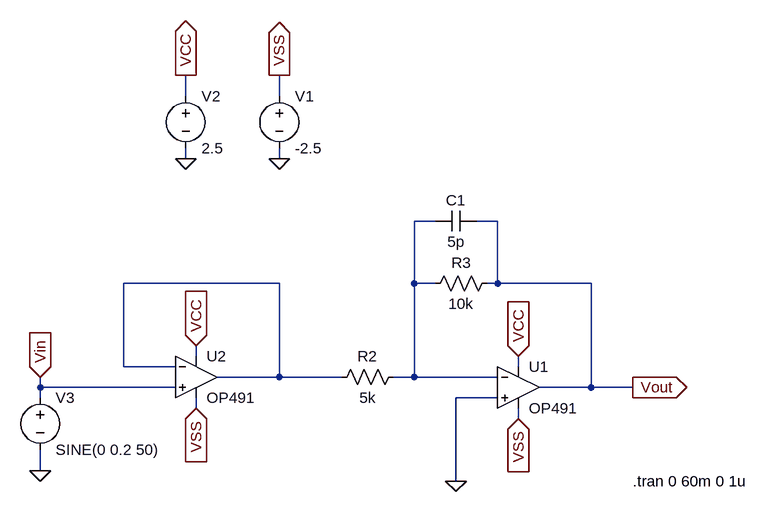
[diagram p0: schematic 008-Two-Stage-Inverting-Amplifier-With-High-Input-Impedance.asc]
008-Two-Stage-Inverting-Amplifier-With-High-Input-Impedance.asc, the LTspice schematic file:
Version 4
SHEET 1 880 680
WIRE -240 -96 -240 -128
WIRE -96 -96 -96 -128
WIRE -240 0 -240 -16
WIRE -96 0 -96 -16
WIRE 144 96 112 96
WIRE 240 96 208 96
WIRE -96 192 -336 192
WIRE 112 192 112 96
WIRE 144 192 112 192
WIRE 240 192 240 96
WIRE 240 192 224 192
WIRE 384 192 240 192
WIRE -224 304 -224 288
WIRE -336 320 -336 192
WIRE -256 320 -336 320
WIRE 272 320 272 304
WIRE -96 336 -96 192
WIRE -96 336 -192 336
WIRE 0 336 -96 336
WIRE 112 336 112 192
WIRE 112 336 80 336
WIRE 240 336 112 336
WIRE -464 352 -464 336
WIRE -256 352 -464 352
WIRE 384 352 384 192
WIRE 384 352 304 352
WIRE 448 352 384 352
WIRE -464 368 -464 352
WIRE 240 368 176 368
WIRE -224 384 -224 368
WIRE 272 400 272 384
WIRE -464 480 -464 448
WIRE 176 496 176 368
FLAG 176 496 0
FLAG -96 0 0
FLAG -240 0 0
FLAG -464 480 0
FLAG -464 336 Vin
IOPIN -464 336 In
FLAG 448 352 Vout
IOPIN 448 352 Out
FLAG -240 -128 VCC
IOPIN -240 -128 Out
FLAG -96 -128 VSS
IOPIN -96 -128 Out
FLAG 272 304 VCC
IOPIN 272 304 In
FLAG 272 400 VSS
IOPIN 272 400 In
FLAG -224 288 VCC
IOPIN -224 288 In
FLAG -224 384 VSS
IOPIN -224 384 In
SYMBOL Opamps\\OP491 272 288 R0
SYMATTR InstName U1
SYMBOL voltage -96 -112 R0
SYMATTR InstName V1
SYMATTR Value -2.5
SYMBOL voltage -240 -112 R0
SYMATTR InstName V2
SYMATTR Value 2.5
SYMBOL res 96 320 R90
WINDOW 0 0 56 VBottom 2
WINDOW 3 32 56 VTop 2
SYMATTR InstName R2
SYMATTR Value 5k
SYMBOL res 240 176 R90
WINDOW 0 0 56 VBottom 2
WINDOW 3 32 56 VTop 2
SYMATTR InstName R3
SYMATTR Value 10k
SYMBOL voltage -464 352 R0
WINDOW 123 0 0 Left 2
WINDOW 39 0 0 Left 2
SYMATTR InstName V3
SYMATTR Value SINE(0 0.2 50)
SYMBOL cap 208 80 R90
WINDOW 0 0 32 VBottom 2
WINDOW 3 32 32 VTop 2
SYMATTR InstName C1
SYMATTR Value 5p
SYMBOL Opamps\\OP491 -224 272 R0
SYMATTR InstName U2
TEXT 448 496 Left 2 !.tran 0 60m 0 1u

The netlist it stands for:
* 008-Two-Stage-Inverting-Amplifier-With-High-Input-Impedance.asc
XU1 0 N001 VCC VSS Vout OP491  ; pins In+ In- V+ V- OUT
V1 VSS 0 -2.5
V2 VCC 0 2.5
R2 N001 N002 5k
R3 Vout N001 10k
V3 Vin 0 SINE(0 0.2 50)
C1 Vout N001 5p
XU2 Vin N002 VCC VSS N002 OP491  ; pins In+ In- V+ V- OUT
.tran 0 60m 0 1u
.backanno
.end